# EAGLE schematic T08 USB Radio Receiver (EAGLE 6.4)
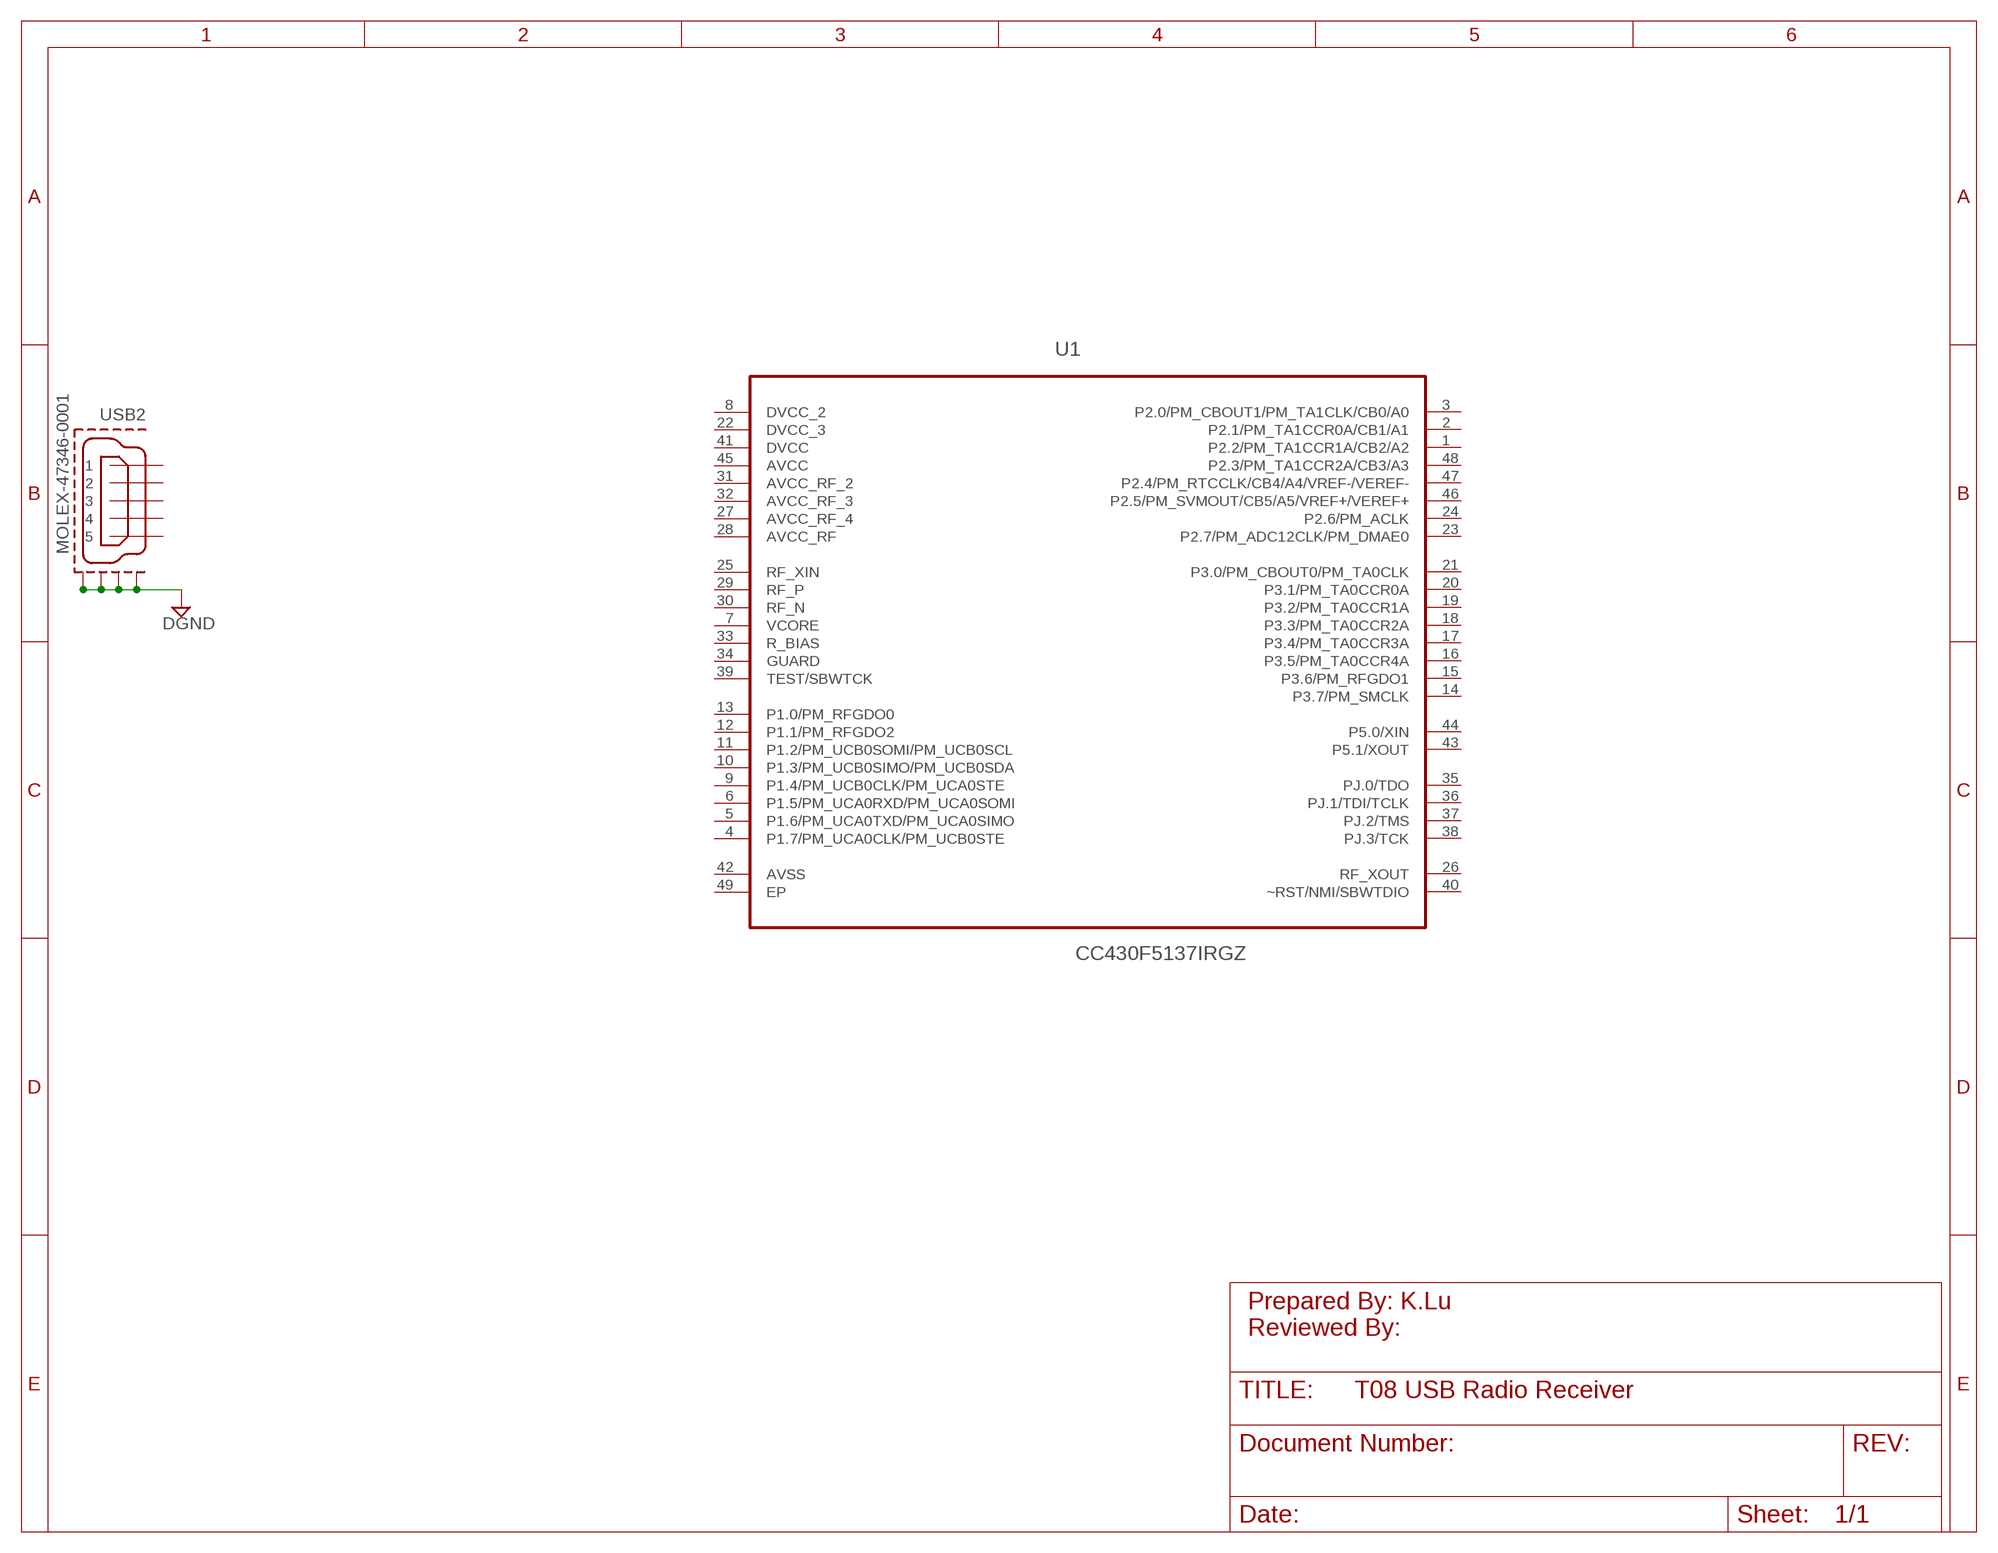
[diagram p0: schematic, sheet 1]

## Parts
U1  CC430F5137IRGZ  [QFN50P700X700X100-49N]
USB2  MOLEX-47346-0001  [MOLEX-47364-0001]

## Nets
DGND: USB2.GND1 USB2.GND2 USB2.GND3 USB2.GND4
Unconnected: U1.1(P2.2/PM_TA1CCR1A/CB2/A2) U1.2(P2.1/PM_TA1CCR0A/CB1/A1) U1.3(P2.0/PM_CBOUT1/PM_TA1CLK/CB0/A0) U1.4(P1.7/PM_UCA0CLK/PM_UCB0STE) U1.5(P1.6/PM_UCA0TXD/PM_UCA0SIMO) U1.6(P1.5/PM_UCA0RXD/PM_UCA0SOMI) U1.7(VCORE) U1.9(P1.4/PM_UCB0CLK/PM_UCA0STE) U1.10(P1.3/PM_UCB0SIMO/PM_UCB0SDA) U1.11(P1.2/PM_UCB0SOMI/PM_UCB0SCL) U1.12(P1.1/PM_RFGDO2) U1.13(P1.0/PM_RFGDO0) U1.14(P3.7/PM_SMCLK) U1.15(P3.6/PM_RFGDO1) U1.16(P3.5/PM_TA0CCR4A) U1.17(P3.4/PM_TA0CCR3A) U1.18(P3.3/PM_TA0CCR2A) U1.19(P3.2/PM_TA0CCR1A) U1.20(P3.1/PM_TA0CCR0A) U1.21(P3.0/PM_CBOUT0/PM_TA0CLK) U1.23(P2.7/PM_ADC12CLK/PM_DMAE0) U1.24(P2.6/PM_ACLK) U1.25(RF_XIN) U1.26(RF_XOUT) U1.29(RF_P) U1.30(RF_N) U1.33(R_BIAS) U1.34(GUARD) U1.35(PJ.0/TDO) U1.36(PJ.1/TDI/TCLK) U1.37(PJ.2/TMS) U1.38(PJ.3/TCK) U1.39(TEST/SBWTCK) U1.40(~RST/NMI/SBWTDIO) U1.42(AVSS) U1.43(P5.1/XOUT) U1.44(P5.0/XIN) U1.46(P2.5/PM_SVMOUT/CB5/A5/VREF+/VEREF+) U1.47(P2.4/PM_RTCCLK/CB4/A4/VREF-/VEREF-) U1.48(P2.3/PM_TA1CCR2A/CB3/A3) U1.49(EP) USB2.1 USB2.2 USB2.3 USB2.4 USB2.5

## Notes on the sheet
- Prepared By: K.Lu
  Reviewed By:

## Power pins joined to a net without a drawn wire
AVCC: U1.45(AVCC)
AVCC_RF: U1.28(AVCC_RF)
AVCC_RF_2: U1.31(AVCC_RF_2)
AVCC_RF_3: U1.32(AVCC_RF_3)
AVCC_RF_4: U1.27(AVCC_RF_4)
DVCC: U1.41(DVCC)
DVCC_2: U1.8(DVCC_2)
DVCC_3: U1.22(DVCC_3)

## Library data of the parts
U1 = CC430F5137IRGZ:CC430F5137IRGZ: MSP430 SoC with RF Core; MPN: CC430F5137IRGZ; OC_FARNELL: -; OC_NEWARK: 68R5911; PACKAGE: QFN-48; SUPPLIER: TEXAS INSTRUMENTS
USB2 = usb_con-update:MOLEX-47346-0001: MICRO USB B, BOTTOM MOUNT